# EAGLE board WP75xx 2 no usb_v (EAGLE 7.7.0)
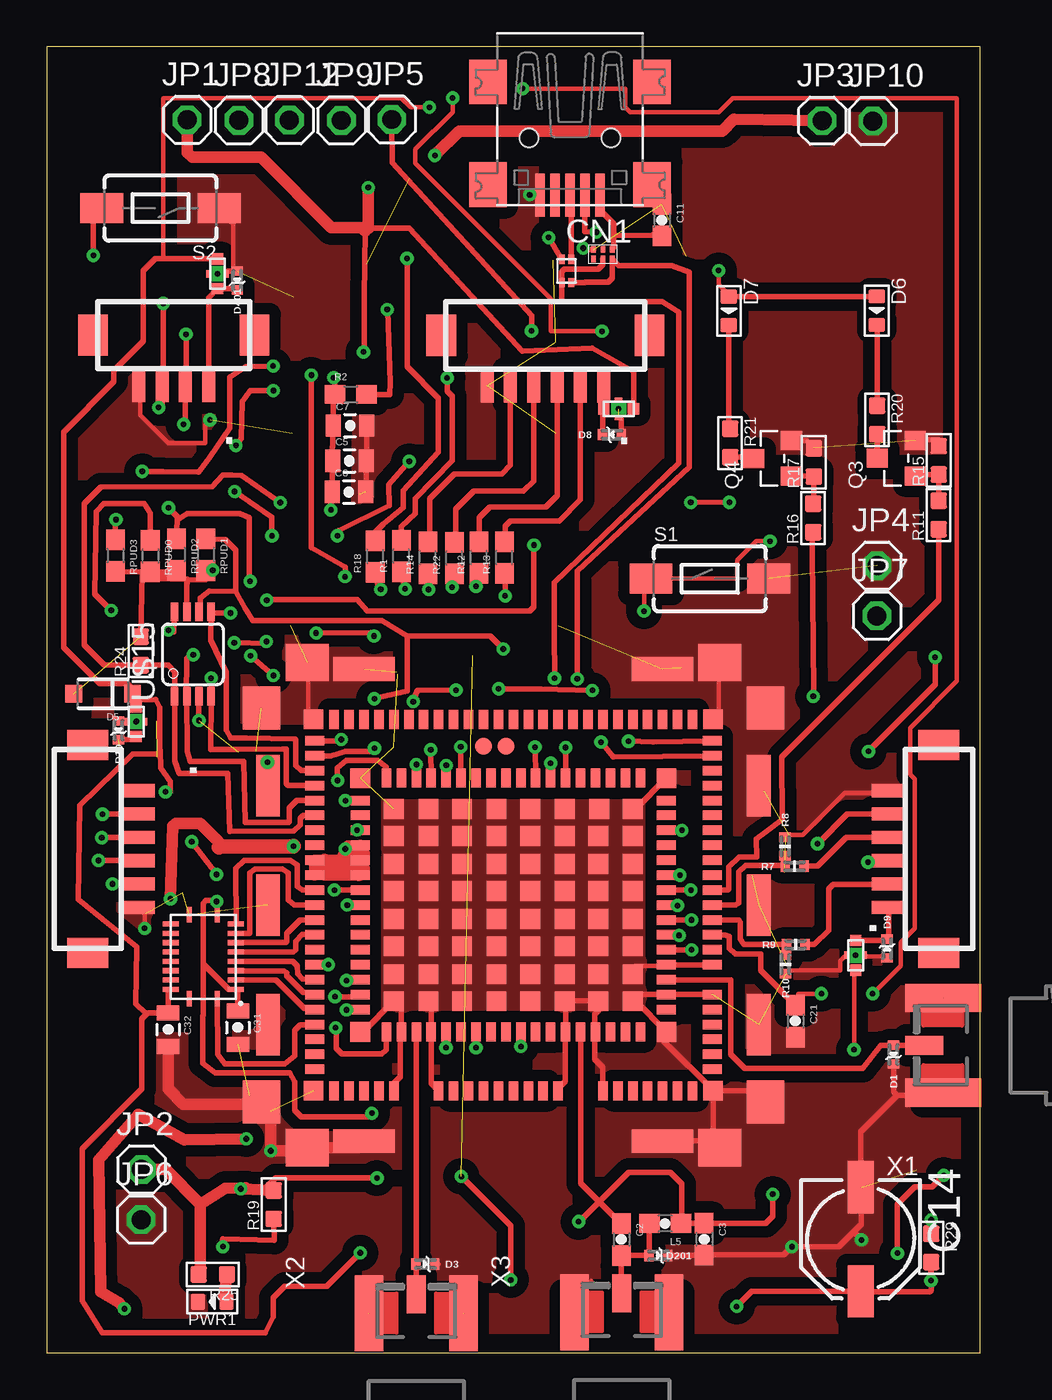
[diagram p1: board, top side]
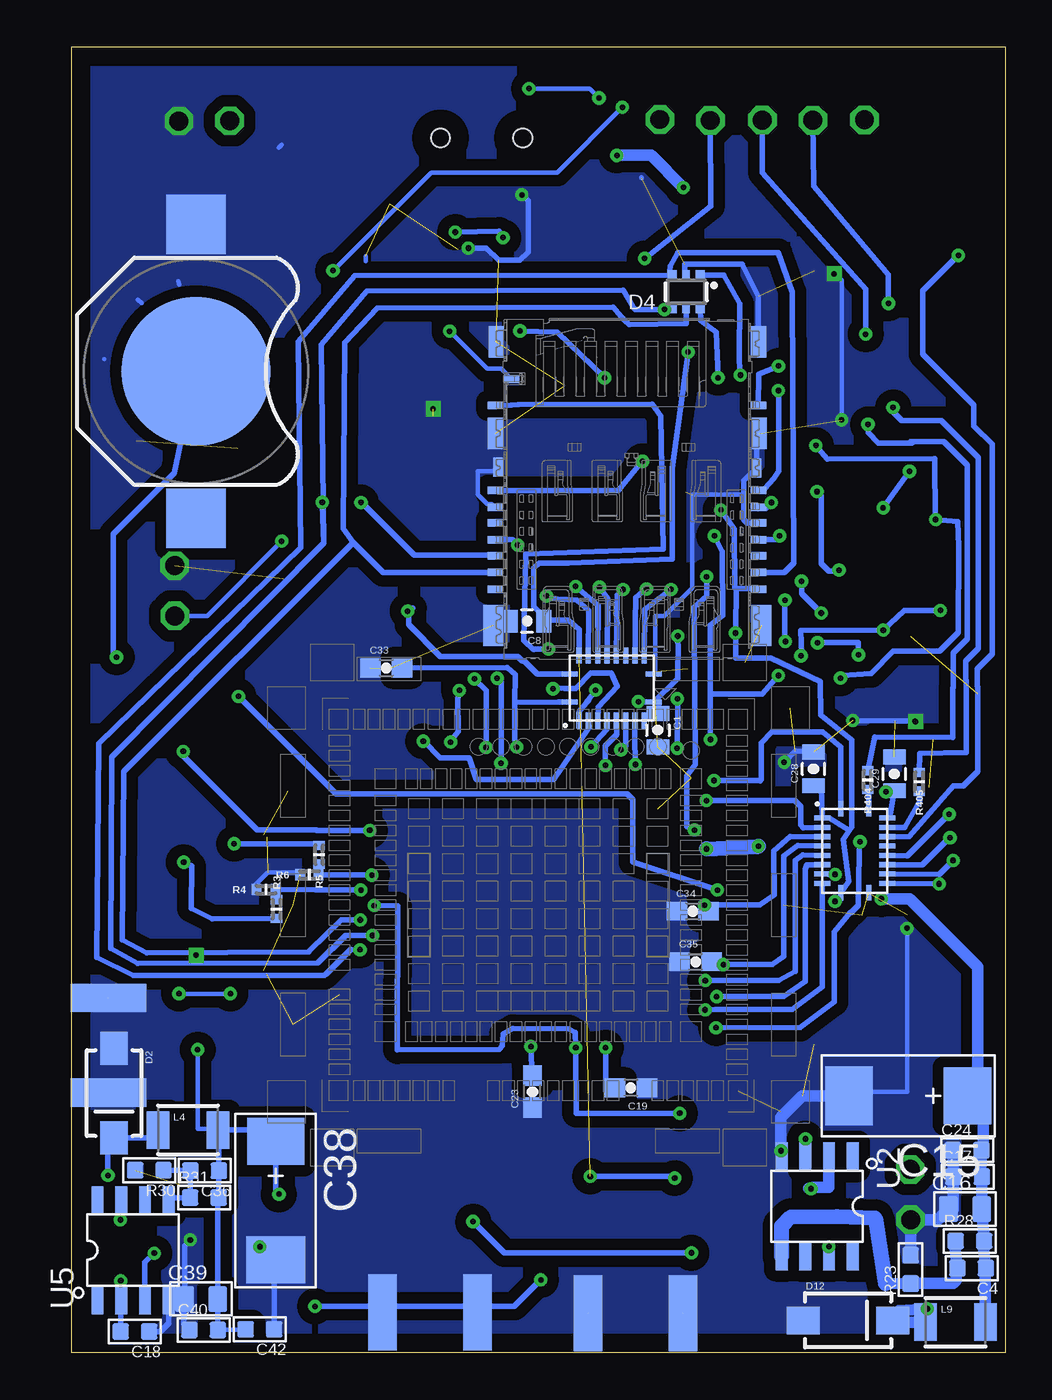
[diagram p2: board, bottom side, seen from below]

Size 50 x 70 mm. Coordinates in mm from the lower left corner, seen from the top.
Outline: 0,0 50,0 50,70 0,70 0,0
Copper layers (1*16): Top 0.035mm / dielectric 1.5mm / Bottom 0.035mm
Design rules "default": minimum track width 10mil, minimum drill 24mil, track to track 8mil, track to pad 8mil, pad to pad 8mil, via to via 8mil, smd to smd 8mil, copper to edge 40mil, drill to drill 8mil, minimum pad ring 10mil, minimum via ring 8mil, stop-mask expansion 4mil, vias tented up to drill 0mil, thermal gap 10mil
Net classes: 0 default: width 0.254 mm, clearance 0.254 mm; 1 power: width 0.15 mm, drill 0.2 mm, clearance 0.152 mm; 3 usbvcc: width 0.508 mm, drill 0.61 mm, clearance 0.254 mm

## Footprints (pad centres in the part's own frame; a part is rotated, then mirrored left to right if it is on the bottom)
BATTCON_12MM = smd 8 x 8: GND 0,0 | smd 3.175 x 3.175: PWR@1 -7.874,0; PWR@2 7.874,0
0805-CAP = smd 0.8 x 1.2: 1 -0.9,0; 2 0.9,0
0603-CAP = smd 1.1 x 1: 1 -0.85,0; 2 0.85,0
C0603 = smd 0.889 x 0.889: 1 -0.762,0; 2 0.762,0
ELECTRO-SMD-D-5.6MM = smd 2.794 x 1.397: + 2.794,0; - -2.794,0
AVX-D = smd 2.54 x 3.048: + -3.175,0 | smd 2.54 x 3.175: - 3.175,0
C0805 = smd 1.016 x 1.397: 1 -0.889,0; 2 0.889,0
USB-MINIB = smd 0.5 x 2.308: D+ 0,4.064; D- -0.8,4.064; GND 1.6,4.064; ID 0.8,4.064; VBUS -1.6,4.064 | smd 2 x 2.4: GND1 -4.4,-2; GND2 -4.4,3.5; GND3 4.4,3.5; GND4 4.4,-2 | hole 1: -2.2,1; 2.2,1
0402-TVS = smd 0.5 x 0.6: A 0.5,0; C -0.5,0
SMA-DIODE-KIT = smd 1.77 x 1.47: A -2.4,0; C 2.4,0
SOT363 = smd 0.5 x 0.5: 1 -0.75,-0.9; 3 0.75,-0.9; 4 0.75,0.9; 6 -0.75,0.9 | smd 0.4 x 0.5: 2 0,-0.9; 5 0,0.9
SOD-123 = smd 0.9 x 0.95: A 1.575,0; C -1.575,0
LED-0603 = smd 0.762 x 0.889: + -0.762,0; - 0.762,0
DF13C-6P-1.25V = smd 0.7 x 1.8: 1 -3.125,0.9; 2 -1.875,0.9; 3 -0.625,0.9; 4 0.625,0.9; 5 1.875,0.9; 6 3.125,0.9 | smd 1.6 x 2.2: M$0 5.575,-1.8; M$1 -5.575,-1.8
DF13C-4P-1.25V = smd 0.7 x 1.8: 1 -1.875,0.9; 2 -0.625,0.9; 3 0.625,0.9; 4 1.875,0.9 | smd 1.6 x 2.2: M$0 4.325,-1.8; M$1 -4.325,-1.8
1X01 = drill 1.016 octagon: 1 0,0
KYOCERA-KNH16-DA = smd 0.6 x 0.6: P$1 -0.8,0; P$2 0.8,0 | smd 0.4 x 0.4: P$3 0,-0.4; P$4 0,0.4 | drill 0.3 pad 0.4 square: P$5 0,0
1210 = smd 1.2 x 2: 1 -1.6,0; 2 1.6,0
0603 = smd 1.1 x 1: 1 -0.85,0; 2 0.85,0
D0603 = smd 0.762 x 0.889: + -0.762,0; - 0.762,0
SOT23 = smd 1.016 x 1.143: 1 -0.95,-1.016; 2 0.95,-1.016; 3 0,1.016
0402-RES = smd 0.5 x 0.6: P$1 -0.5,0; P$2 0.5,0
R0603 = smd 0.889 x 0.889: 1 -0.762,0; 2 0.762,0
TACTILE-SWITCH-1101NE = smd 2.3 x 1.6: 1 -3.15,0; 2 3.15,0
QFN20-RGY = smd 0.28 x 0.85: 1 -0.75,2.25; 10 -0.75,-2.25; 11 0.75,-2.25; 20 0.75,2.25 | smd 0.85 x 0.28: 2 -1.75,1.75; 3 -1.75,1.25; 4 -1.75,0.75; 5 -1.75,0.25; 6 -1.75,-0.25; 7 -1.75,-0.75; 8 -1.75,-1.25; 9 -1.75,-1.75; 12 1.75,-1.75; 13 1.75,-1.25; 14 1.75,-0.75; 15 1.75,-0.25; 16 1.75,0.25; 17 1.75,0.75; 18 1.75,1.25; 19 1.75,1.75
SOP8 = smd 0.635 x 1.524: 1 -1.905,-2.667; 2 -0.635,-2.667; 3 0.635,-2.667; 4 1.905,-2.667; 5 1.905,2.667; 6 0.635,2.667; 7 -0.635,2.667; 8 -1.905,2.667
SOCKET_WP75XX = smd 0.508 x 1.016: P$1 6.8,-6.8; P$2 6,-6.8; P$3 5.2,-6.8; P$4 4.4,-6.8; P$5 3.6,-6.8; P$6 2.8,-6.8; P$7 2,-6.8; P$8 1.2,-6.8; P$9 0.4,-6.8; P$10 -0.4,-6.8; P$11 -1.2,-6.8; P$12 -2,-6.8; P$13 -2.8,-6.8; P$14 -3.6,-6.8; P$15 -4.4,-6.8; P$16 -5.2,-6.8; P$17 -6,-6.8; P$18 -6.8,-6.8; P$34 -6.8,6.8; P$35 -6,6.8; P$36 -5.2,6.8; P$37 -4.4,6.8; P$38 -3.6,6.8; P$39 -2.8,6.8; P$40 -2,6.8; P$41 -1.2,6.8; P$42 -0.4,6.8; P$43 0.4,6.8; P$44 1.2,6.8; P$45 2,6.8; P$46 2.8,6.8; P$47 3.6,6.8; P$48 4.4,6.8; P$49 5.2,6.8; P$50 6,6.8; P$51 6.8,6.8; P$71 9.6,-9.95; P$72 8.8,-9.95; P$73 8,-9.95; P$74 7.2,-9.95; P$75 6.4,-9.95; P$76 5.6,-9.95; P$77 4.8,-9.95; P$78 4,-9.95; P$79 3.2,-9.95; P$80 2.4,-9.95; P$81 1.6,-9.95; P$82 0.8,-9.95; P$83 0,-9.95; P$84 -0.8,-9.95; P$85 -1.6,-9.95; P$86 -2.4,-9.95; P$87 -3.2,-9.95; P$88 -4,-9.95; P$89 -4.8,-9.95; P$90 -5.6,-9.95; P$91 -6.4,-9.95; P$92 -7.2,-9.95; P$93 -8,-9.95; P$94 -8.8,-9.95; P$95 -9.6,-9.95; P$119 -9.6,9.95; P$120 -8.8,9.95; P$121 -8,9.95; P$122 -7.2,9.95; P$123 -6.4,9.95; P$124 -5.6,9.95; P$125 -4.8,9.95; P$128 -2.4,9.95; P$129 -1.6,9.95; P$130 -0.8,9.95; P$131 0,9.95; P$132 0.8,9.95; P$133 1.6,9.95; P$134 2.4,9.95; P$135 3.2,9.95; P$136 4,9.95; P$139 6.4,9.95; P$140 7.2,9.95; P$141 8,9.95; P$142 8.8,9.95; P$143 9.6,9.95 | smd 1.016 x 0.508: P$19 -8.2,-5.6; P$20 -8.2,-4.8; P$21 -8.2,-4; P$22 -8.2,-3.2; P$23 -8.2,-2.4; P$24 -8.2,-1.6; P$25 -8.2,-0.8; P$26 -8.2,0; P$27 -8.2,0.8; P$28 -8.2,1.6; P$29 -8.2,2.4; P$30 -8.2,3.2; P$31 -8.2,4; P$32 -8.2,4.8; P$33 -8.2,5.6; P$52 8.2,5.6; P$53 8.2,4.8; P$54 8.2,4; P$55 8.2,3.2; P$56 8.2,2.4; P$57 8.2,1.6; P$58 8.2,0.8; P$59 8.2,0; P$60 8.2,-0.8; P$61 8.2,-1.6; P$62 8.2,-2.4; P$63 8.2,-3.2; P$64 8.2,-4; P$65 8.2,-4.8; P$66 8.2,-5.6; P$96 -10.65,-8.8; P$97 -10.65,-8; P$98 -10.65,-7.2; P$99 -10.65,-6.4; P$100 -10.65,-5.6; P$101 -10.65,-4.8; P$102 -10.65,-4; P$103 -10.65,-3.2; P$104 -10.65,-2.4; P$105 -10.65,-1.6; P$106 -10.65,-0.8; P$107 -10.65,0; P$108 -10.65,0.8; P$109 -10.65,1.6; P$110 -10.65,2.4; P$111 -10.65,3.2; P$113 -10.65,4.8; P$114 -10.65,5.6; P$115 -10.65,6.4; P$116 -10.65,7.2; P$117 -10.65,8; P$118 -10.65,8.8; P$144 10.65,8.8; P$145 10.65,8; P$146 10.65,7.2; P$147 10.65,6.4; P$148 10.65,5.6; P$149 10.65,4.8; P$150 10.65,4; P$151 10.65,3.2; P$152 10.65,2.4; P$153 10.65,1.6; P$154 10.65,0.8; P$155 10.65,0; P$156 10.65,-0.8; P$157 10.65,-1.6; P$158 10.65,-2.4; P$159 10.65,-3.2; P$160 10.65,-4; P$161 10.65,-4.8; P$162 10.65,-5.6; P$163 10.65,-6.4; P$164 10.65,-7.2; P$165 10.65,-8; P$166 10.65,-8.8 | smd 1.05 x 1.05: P$67 8.2,-6.8; P$68 -8.2,-6.8; P$69 -8.2,6.8; P$70 8.2,6.8; P$167 10.7,-9.95; P$168 -10.7,-9.95; P$169 -10.7,9.95; P$170 10.7,9.95 | smd 1.06 x 1.06: P$171 6.4,-5.15; P$172 6.4,-3.7; P$173 6.4,-2.2; P$174 6.4,-0.75; P$175 6.4,0.75; P$176 6.4,2.2; P$177 6.4,3.7; P$178 6.4,5.15; P$179 4.55,5.15; P$180 2.75,5.15; P$181 0.9,5.15; P$182 -0.9,5.15; P$183 -2.75,5.15; P$184 -4.55,5.15; P$185 -6.4,5.15; P$186 -6.4,3.7; P$187 -6.4,2.2; P$188 -6.4,0.75; P$189 -6.4,-0.75; P$190 -6.4,-2.2; P$191 -6.4,-3.7; P$192 -6.4,-5.15; P$193 -4.6,-5.15; P$194 -2.75,-5.15; P$195 -0.9,-5.15; P$196 0.9,-5.15; P$197 2.75,-5.15; P$198 4.55,-5.15; P$199 4.55,-3.7; P$200 4.55,-2.2; P$201 4.55,-0.75; P$202 4.55,0.75; P$203 4.55,2.2; P$204 4.55,3.7; P$205 2.75,3.7; P$206 0.9,3.7; P$207 -0.9,3.7; P$208 -2.75,3.7; P$209 -4.55,3.7; P$210 -4.55,2.2; P$211 -4.55,0.75; P$212 -4.55,-0.75; P$213 -4.55,-2.2; P$214 -4.55,-3.7; P$215 -2.75,-3.7; P$216 -0.9,-3.7; P$217 0.9,-3.7; P$218 2.75,-3.7; P$219 2.75,-2.2; P$220 2.75,-0.75; P$221 2.75,0.75; P$222 2.75,2.2; P$223 0.9,2.2; P$224 -0.9,2.2; P$225 -2.75,2.2; P$226 -2.75,0.75; P$227 -2.75,-0.75; P$228 -2.75,-2.2; P$229 -0.9,-2.2; P$230 0.9,-2.2; P$231 0.9,-0.75; P$232 0.9,0.75; P$233 -0.9,0.75; P$234 -0.9,-0.75 | smd 0.9 x 0.9: P$240 1.6,-8.5; P$241 0.4,-8.5 | smd 1.27 x 3.3: P$245 -13.15,-6.4; P$246 -13.15,0; P$247 -13.15,6.4; P$250 13.15,6.4; P$251 13.15,0; P$252 13.15,-6.4 | smd 3.3 x 1.27: P$248 -8,12.65; P$249 8,12.65; P$253 8,-12.65; P$254 -8,-12.65 | smd 2 x 2.3: P$255 -13.5,-10.55; P$258 13.5,-10.55; P$259 13.5,10.55; P$262 -13.5,10.55 | smd 2.3 x 2: P$256 -11.05,-13; P$257 11.05,-13; P$260 11.05,13; P$261 -11.05,13
TCM1210G = smd 0.3 x 0.5: 1 -0.25,-0.75; 2 0.25,-0.75; 3 0.25,0.5; 4 -0.25,0.5
TPD4S012 = smd 0.35 x 0.25: P$1 -0.25,-0.5; P$2 -0.25,0; P$3 -0.25,0.5; P$4 0.25,0.5; P$5 0.25,0; P$6 0.25,-0.5
SIM_SD_HOLDER = smd 0.813 x 0.406: - -6.95,0; -- -6.95,-3.55; C1 7.15,-3.55; C2 7.15,-2.65; C3 -6.95,-2.65; C4 7.15,0; C5 7.15,-1.75; C6 -6.95,-1.75; SW -6.07,7.71; T1 7.15,6.3; T2 7.15,1.75; T3 7.15,0.85; T4 7.15,-0.9; T5 -6.95,-0.9; T6 -6.95,0.85; T7 -6.95,1.75; T8 -6.95,6.3 | smd 1.067 x 2.184: G1 -7.05,-5.5; G8 7.3,-5.5 | smd 0.508 x 1.016: G2 -6.8,3; G7 7.05,2.95 | smd 0.813 x 1.676: G3 -6.95,4.8; G4 -6.9,9.7; G5 7.15,9.7; G6 7.2,4.8
MSOP8 = smd 0.4 x 1: 1 -0.976,-2.263; 2 -0.326,-2.263; 3 0.324,-2.263; 4 0.974,-2.263; 5 0.974,2.262; 6 0.324,2.262; 7 -0.326,2.262; 8 -0.976,2.262
SMA_EDGELAUNCH_UFL = smd 4.064 x 1.524: GND@1 2.032,-2.54; GND@2 2.032,2.54 | smd 4.064 x 1.524 bottom: GND@3 2.032,2.54; GND@4 2.032,-2.54 | smd 2.032 x 1.016: P 3.048,0

## Placement (x,y rotation side)
BAT2  [BATTCON_12MM]  43.34,52.6 270 bottom
C1  100nf  [0805-CAP]  18.6,33.37 270 bottom
C2  15pf  [0603-CAP]  30.79,6.08 270 top
C3  22pf  [0603-CAP]  35.22,6.1 270 top
C4  DNP  [C0603]  1.79,4.53 180 bottom
C5  100nf  [0805-CAP]  16.22,47.8 0 top
C6  10nf  [0805-CAP]  16.2,46.14 0 top
C7  4.7uf  [0805-CAP]  16.25,49.69 0 top
C8  100nf  [0805-CAP]  25.61,39.21 180 bottom
C11  10uf  [0603-CAP]  32.96,60.71 270 top
C14  16V 220uF  [ELECTRO-SMD-D-5.6MM]  43.6,6.09 270 top
C15  470uF  [AVX-D]  5.18,13.77 180 bottom
C16  10uF  [C0805]  2.14,7.7 0 bottom
C17  100nF  [C0603]  2,9.44 0 bottom
C18  100nF  [C0603]  46.61,1.14 180 bottom
C19  22pf  [0603-CAP]  20.04,14.21 180 bottom
C21  22pf  [0603-CAP]  40.11,17.78 270 top
C23  22pf  [0603-CAP]  25.31,13.99 90 bottom
C24  100nF  [C0603]  2.03,10.86 0 bottom
C28  100nf  [0805-CAP]  10.26,31.29 90 bottom
C29  100nf  [0805-CAP]  5.93,31.02 90 bottom
C31  100nf  [0805-CAP]  10.24,17.43 270 top
C32  100nf  [0805-CAP]  6.51,17.32 270 top
C33  22pf  [0603-CAP]  33.15,36.7 0 bottom
C34  22pf  [0603-CAP]  16.73,23.67 0 bottom
C35  22pf  [0603-CAP]  16.58,20.96 0 bottom
C36  DNP  [C0603]  42.88,9.77 180 bottom
C38  470uF  [AVX-D]  39.07,8.16 270 bottom
C39  10uF  [C0805]  43.07,2.89 0 bottom
C40  100nF  [C0603]  42.93,1.22 0 bottom
C42  100nF  [C0603]  39.92,1.26 180 bottom
CN1  [USB-MINIB]  28.04,66.11 180 top
D1  [0402-TVS]  45.37,15.98 90 top
D2  [SMA-DIODE-KIT]  47.73,13.92 270 bottom
D3  [0402-TVS]  20.29,4.76 180 top
D4  SMF05C  [SOT363]  17.08,56.86 180 bottom
D5  [SOD-123]  3.03,35.32 180 top
D6  green  [LED-0603]  44.46,55.85 270 top
D7  green  [LED-0603]  36.55,55.84 270 top
D8  PESD0402-140  [0402-TVS]  30.28,49.21 0 top
D9  PESD0402-140  [0402-TVS]  45.02,21.66 270 top
D10  PESD0402-140  [0402-TVS]  3.85,33.37 90 top
D12  [SMA-DIODE-KIT]  8.4,1.74 0 bottom
D201  [0402-TVS]  32.77,5.21 180 top
D401  [0402-TVS]  10.21,57.47 90 top
J1  DF13C-6P-1.25V  [DF13C-6P-1.25V]  4,27 270 top
J5  DF13C-6P-1.25V  [DF13C-6P-1.25V]  46,27 90 top
J201  [DF13C-6P-1.25V]  26.72,52.73 180 top
J401  [DF13C-4P-1.25V]  6.81,52.75 180 top
JP1  [1X01]  7.53,66.08 0 top
JP2  [1X01]  5.08,9.82 0 top
JP3  [1X01]  41.54,66.03 0 top
JP4  [1X01]  44.48,42.19 0 top
JP5  [1X01]  18.49,66.1 0 top
JP6  [1X01]  5.06,7.14 0 top
JP7  [1X01]  44.47,39.49 0 top
JP8  [1X01]  10.29,66.05 0 top
JP9  [1X01]  15.79,66.05 0 top
JP10  [1X01]  44.25,66.01 0 top
JP12  [1X01]  13,66.07 0 top
L1  KNH16C104DA5TS  [KYOCERA-KNH16-DA]  4.79,33.83 270 top
L3  KNH16C104DA5TS  [KYOCERA-KNH16-DA]  43.34,21.3 90 top
L4  10uh  [1210]  43.77,11.95 0 bottom
L5  [0603]  33.14,6.94 180 top
L7  [KYOCERA-KNH16-DA]  9.15,57.83 270 top
L9  10uh  [1210]  2.65,1.65 0 bottom
L201  KNH16C104DA5TS  [KYOCERA-KNH16-DA]  30.64,50.59 180 top
PWR1  Red  [D0603]  8.87,2.75 180 top
Q3  9013  [SOT23]  45.51,47.95 90 top
Q4  9013  [SOT23]  38.89,47.93 90 top
R1  120r  [0603]  19,42.7 90 top
R2  15k  [0603]  16.29,51.36 0 top
R3  10K/0.1%  [0402-RES]  39.03,23.78 270 bottom
R4  10K/0.1%  [0402-RES]  39.59,24.83 0 bottom
R5  10K/0.1%  [0402-RES]  36.75,26.69 90 bottom
R6  10K/0.1%  [0402-RES]  37.27,25.62 0 bottom
R7  10K/0.1%  [0402-RES]  40.07,26.08 0 top
R8  10K/0.1%  [0402-RES]  39.56,27.14 270 top
R9  10K/0.1%  [0402-RES]  40.13,21.88 0 top
R10  10K/0.1%  [0402-RES]  39.58,20.82 90 top
R11  4.7k  [R0603]  47.78,44.9 90 top
R12  120r  [0603]  23.15,42.62 90 top
R13  120r  [0603]  24.52,42.62 90 top
R14  120r  [0603]  20.42,42.6 90 top
R15  47k  [R0603]  47.79,47.83 90 top
R16  4.7k  [R0603]  41.06,44.74 90 top
R17  47k  [R0603]  41.1,47.72 90 top
R18  120r  [0603]  17.61,42.67 90 top
R19  100k  [R0603]  12.16,7.95 90 top
R20  1k  [R0603]  44.49,50 270 top
R21  1K  [R0603]  36.61,48.76 270 top
R22  120r  [0603]  21.84,42.6 90 top
R23  10k 1%  [R0603]  5.06,4.47 90 bottom
R24  1K  [R0603]  5.04,37.62 90 top
R25  330  [R0603]  8.9,4.2 180 top
R28  24k 1%  [R0603]  1.89,5.99 0 bottom
R29  100k  [R0603]  47.38,5.63 270 top
R30  10k 1%  [R0603]  45.84,9.78 180 bottom
R31  24k 1%  [R0603]  42.89,8.32 0 bottom
R404  120R  [0402-RES]  7.36,30.7 90 bottom
R405  120R  [0402-RES]  4.59,30.61 90 bottom
RPUD0  47k  [0603]  5.55,42.7 270 top
RPUD1  47k  [0603]  8.52,42.77 270 top
RPUD2  47k  [0603]  6.96,42.78 270 top
RPUD3  47k  [0603]  3.68,42.73 270 top
S1  [TACTILE-SWITCH-1101NE]  35.52,41.49 0 top
S2  [TACTILE-SWITCH-1101NE]  6.1,61.35 180 top
U1  TXS0108QFN20  [QFN20-RGY]  8.05,26.91 0 bottom
U2  TD1410  [SOP8]  10.06,7.86 180 bottom
U3  TXS0108QFN20  [QFN20-RGY]  8.39,21.23 180 top
U5  TD1410  [SOP8]  46.71,5.51 0 bottom
U201  TXS0108QFN20  [QFN20-RGY]  21.07,35.63 90 bottom
U$1  SOCKETY_WP75XXX  [SOCKET_WP75XX]  25,24 180 top
U$11  TCM1210G  [TCM1210G]  27.85,58.1 0 top
U$12  TPD4S012  [TPD4S012]  29.8,58.88 90 top
U$14  SD_SIM_M1610  [SIM_SD_HOLDER]  20.36,44.47 0 bottom
U$15  PACDN006  [MSOP8]  7.83,37.45 0 top
X1  uFL  [SMA_EDGELAUNCH_UFL]  50.06,16.48 180 top
X2  uFL  [SMA_EDGELAUNCH_UFL]  19.8,0.08 90 top
X3  uFL  [SMA_EDGELAUNCH_UFL]  30.81,0.14 90 top

## Tracks (layer width: path | path; a pad name or v marks a point on that pad's centre or on a via)
1.8V  (via drill 0.3)
  Top 0.254: 15.3,46.25 15.25,46.25 C6.1
  Top 0.305: U$1.P$26 v33.8,23.97 | U$1.P$45 22.98,16.55 v23,16.35 | C31.1 10.24,19.38 U3.2 9.76,19.48 8.38,20.85 | 8.38,20.85 8.38,24.09 8.53,24.23 9.04,24.23 9.14,24.14 | 9.14,24.14 U3.10 | 8.38,20.85 8.38,18.08 8.36,18.06 8.36,15.51 9.04,15.01 13.02,15.01 13.29,14.52 13.29,13.01 13.64,12.66 17.24,12.66 v17.42,12.84 | v9.11,24.19 9.11,24.24 9.14,24.14 | v17.53,38.41 17.39,38.59 v14.44,38.58 | v15.22,45.17 15.22,46.06 C6.1 | 15.3,46.11 15.3,46.25 15.3,48.26 | 15.3,48.26 15.3,48.54 15.34,48.57 15.34,49.68 C7.1 15.35,51.28 R2.1 15.44,52.19 v15.37,52.26 | C5.1 15.32,48.24 15.3,48.26 | v19.64,34.9 19.87,35.51 v21.93,35.52
  Bottom 0.254: 14.42,38.75 14.5,38.75 v14.44,38.58
  Bottom 0.305: v33.8,23.97 32.54,23.94 32.56,16.24 27.1,16.28 26.93,16.44 26.89,17.09 26.37,17.39 23.38,17.37 23.02,17.17 v23,16.36 v23,16.35 22.98,12.86 22.96,12.84 v17.42,12.84 | C28.1 9.85,30.42 U1.2 9.42,28.65 8.35,27.99 | 8.35,27.99 8.66,27.51 8.36,25.26 U1.10 8.84,24.27 v9.11,24.19 | 8.35,27.99 8.2,28.19 8.22,32.83 9.87,34.18 9.89,35.98 12.55,37.25 14.44,37.24 14.42,38.75 14.4,41 14.47,41.03 | 14.47,41.03 14.46,40.95 13.74,40.95 U$14.C1 | 14.47,41.03 14.5,44.13 14.79,44.58 v15.22,45.17 | D4.6 16.31,55.31 15.88,54.99 15.47,54.7 v15.37,52.26 | v17.53,38.41 17.52,37.6 17.54,36.68 17.52,36.14 U201.10 | U201.2 22.8,34.38 22.31,34.99 22.4,34.89 v21.93,35.52 | U201.10 19.62,34.88 v19.64,34.9 | C1.1 18.54,34.88 U201.10
3.7V  (via drill 0.3)
  Top 0.305: 15.82,26.56 16.14,26 v16,27.01
  Top 0.61: U$1.P$63 17.02,26.78 16.16,27.16 | 16.16,27.16 16.41,25.99 14.88,26.44 14.88,26.4 U$1.P$158 U$1.P$157 | U$1.P$62 14.9,26.4 14.9,25.61 15.35,25.61 | 16.16,27.16 15.82,26.56 16.73,25.59 15.35,25.61 | 15.35,25.61 15.35,26.03 17.01,25.97 U$1.P$61 | 9.23,27.11 9.23,27.39 8.24,28.38 6.9,28.38 6.75,28.23 v6.63,24.33
  Top 0.813: v13.21,27.15 9.23,27.11
  Bottom 0.61: v6.63,24.33 5.11,24.33 1.46,20.68 1.46,14.32 C15.+ 2,13.29 1.15,12.44 1.15,10.83 C24.2 1.29,9.23 C17.2 1.25,9.16 C16.2 1.21,7.37 R28.2 1.14,5.43 C4.1 1.05,4.51 L9.2
  Bottom 0.813: v16,27.01 v13.21,27.15
21
  Top 0.305: U3.1 9.15,16 9.53,15.49 12.77,15.49 13.28,15.9 13.29,17.28 13.59,17.57 14.32,17.57 U$1.P$147
22
  Top 0.305: U3.3 12.28,20 13.79,18.45 14.34,18.41 U$1.P$148
23
  Top 0.305: U3.4 12.7,20.48 12.86,20.35 12.85,20.2 13.74,19.3 U$1.P$149
24
  Top 0.305: U3.5 13.19,20.98 13.43,20.75 13.45,20.31 13.7,20.05 14.34,20.01 U$1.P$150
28
  Top 0.305: U3.6 13.21,21.48 13.34,21.61 13.34,22.05 13.7,22.41 14.34,22.41 U$1.P$153
29
  Top 0.305: U$1.P$154 13.59,23.2 12.87,22.48 12.87,22.06 12.81,22 10.16,22 U3.7
30
  Top 0.305: U3.8 10.84,22.48 10.88,22.51 10.88,25.72 11.18,25.94 12.62,25.94 12.93,25.72 12.94,24.28 13.26,23.99 U$1.P$155
31
  Top 0.305: U$1.P$156 13.7,24.8 13.43,24.99 13.43,26.16 13.05,26.38 10.59,26.38 10.14,25.95 10.15,23 U3.9
+3V3  (via drill 0.3)
  Top 0.254: v43.25,16.25 43.25,20.5 L3.P$1 | v36,58 36,57.25 36.5,56.75 D7.+ | v20.5,66.75 19.5,66.75 19,67.25 6.25,67.25 6.25,58.63 | 5,34.99 5,35 4.75,35.25 D5.C
  Top 0.305: C32.1 6.51,19.35 U3.19 | v6.37,30.06 6.63,30.06 6.63,30.61 6.1,31.33 6.1,31.52 6.08,32.1 | 6.08,32.1 6.06,32.59 6.07,34.57 5.84,35.01 5,34.99 4.93,34.99 L1.P$1 | C32.1 5.27,18.23 4.79,18.71 4.83,21.77 1.69,24.29 1.76,29.35 4.6,32.08 6.06,32.08 6.08,32.1 | C32.1 5.42,18.23 5.1,17.91 5.1,14.15 1.9,10.95 1.9,2.78 2.98,1.09 11.71,1.09 12.13,1.93 12.13,2.94 12.77,3.57 15.01,3.57 v16.8,5.36 | v28.5,7.03 28.53,7.03 31.18,9.68 33.4,9.68 34.03,9.05 34.03,6.99 L5.1 C3.1 38.51,6.94 38.9,7.32 v38.9,8.5 | L7.P$1 6.25,58.63 5.81,58.63 5.18,58 5.18,54.23 3.6,52.65 3.6,52.04 0.9,49.34 0.9,37.81 2.83,35.88 4.31,35.88 4.6,35.58 D5.C | D7.+ 44.45,56.6 D6.+
  Bottom 0.254: v43.25,16.25 43.25,12 42.25,12 L4.2 | C42.2 40.75,1.25 42,1.25 C40.2 | v36,58 30.75,63.25 24,63.25 v20.5,66.75
  Bottom 0.305: U1.19 6.17,28.68 C29.1 6.31,30.12 v6.37,30.06 | v16.8,5.36 26.83,5.36 v28.5,7.03 | C40.2 42.18,1.23 C39.2 42.18,8.27 R31.2 42.13,9.75 C36.1 42.11,11.89 L4.2 39.68,11.95 C38.+ 39.07,8.68 v38.9,8.5
+5V  (via drill 0.3)  (1 unrouted)
  Top 0.305: R25.2 8.23,4.13 | 10.68,8.85 v10.39,8.79 10.54,8.65 11.55,8.65 12.28,9.37 v17.69,9.37 | v47.37,3.87 47.37,4.85 R29.2 47.38,3.34 47.31,3.27 43.63,3.27 C14.+ 37.77,3.29 v36.97,2.49 | v24.86,3.91 24.86,6.81 v22.22,9.45 | L201.P$1 31.44,52.58 29.22,53.85 25.48,53.68 19.42,60.26 17.26,60.28 17.08,60.29 17.08,60.11 17.01,56.6 17.01,53.67 v16.97,53.63
  Top 0.61: R19.2 v10.39,8.79 | 8.23,4.13 8.23,4.46 8.24,7.97 | 8.24,7.97 9.57,8.83 10.68,8.85 | JP2.1 6.39,9.82 8.24,7.97 | JP1.1 7.53,64.33 7.79,64.06 11.49,64.06 15.26,60.3 16.89,60.3 17.08,60.11 | JP3.1 36.82,66.1 36.19,65.48 22.1,65.48 v20.8,64.17 | v17.23,62.45 17.23,60.31 17.26,60.28
  Bottom 0.254: 10.25,8.87 10.25,9 v10.39,8.79 | 17.5,9.5 v17.69,9.37
  Bottom 0.305: U201.19 22.82,38.77 23.39,39.27 24.65,39.27 C8.1 24.71,39.49 25.24,40.01 25.24,42.06 24.96,42.32 23.41,42.32 17.83,42.54 17.83,47.42 v16.97,53.63 | C18.2 47.37,2.81 U5.2 47.35,3.84 v47.37,3.87 | v36.97,2.49 26.28,2.49 v24.86,3.91 | v22.22,9.45 17.78,9.45 v17.69,9.37
  Bottom 0.61: U2.2 9.43,8.87 10.25,8.87 10.28,8.87 | v10.39,8.79 10.52,8.82 | v20.8,64.17 18.95,64.17 v17.23,62.45
ADC0  (via drill 0.3)
  Top 0.305: U$1.P$25 v34.51,24.8
  Bottom 0.305: v34.51,24.8 36.86,24.8 36.79,24.82 36.93,24.81 R4.P$2 39.09,24.16 R3.P$1
ADC1  (via drill 0.3)
  Top 0.305: U$1.P$24 v33.92,25.6
  Bottom 0.254: R6.P$2 36.75,25.75 36.75,25.6
  Bottom 0.305: v33.92,25.6 36.75,25.6 36.78,25.6 36.79,25.59 | R5.P$1 36.8,25.65 R6.P$2
ADC2
  Top 0.254: R8.P$2 39.75,26.5 39.75,26.25 R7.P$1 39.5,26.25 39.43,26.12
  Top 0.305: U$1.P$107 36.9,24 37.08,24.1 37.08,25.76 37.44,26.12 39.43,26.12
ADC3
  Top 0.254: R10.P$2 39.75,21.5 39.75,21.75 R9.P$1 39.5,22 39.42,21.9
  Top 0.305: U$1.P$108 37.09,23.2 37.15,23.07 37.15,22.18 37.34,21.9 39.42,21.9
BAT_RTC  (via drill 0.3)
  Top 0.305: U$1.P$21 v34.03,28 | v47.6,37.28 47.6,35.81 v44.02,32.23
  Bottom 0.305: v34.03,28 36.86,28 36.89,28.03 40.07,28.03 44.02,31.98 v44.02,32.23 | BAT2.GND 44.5,47.14 47.77,43.87 47.77,37.45 v47.6,37.28
BOOT_TPI  (via drill 0.3)
  Top 0.305: U$1.P$47 v21.39,16.36
  Bottom 0.254: C19.2 21,14.25 21.25,14.25 21.4,14.25
  Bottom 0.305: v21.39,16.36 21.4,14.25 21.4,14.03
D+  (via drill 0.3)
  Top 0.305: U$1.P$13 v27.8,32.44 | v28.42,36.12 28.41,38.78 28.41,41.91 34.42,47.47 34.42,57.92 33.49,58.27 30.66,58.27 U$12.P$1 30.3,57.6 30.09,57.39 28.86,57.39 28.83,57.35 U$11.2
  Bottom 0.305: v27.8,32.44 27.8,35.21 27.79,35.22 27.79,35.48 v28.42,36.12
D-  (via drill 0.3)
  Top 0.305: U$1.P$12 v27,31.6 | v27.21,36.15 27.18,38.64 27.19,38.64 27.19,41.29 33.87,47.68 33.87,55.76 32.97,56.33 27.73,56.33 27.6,56.45 U$11.1 27.58,57.37 27.58,57.93 27.72,58.07 29.54,58.07 29.8,58.33 U$12.P$2
  Bottom 0.305: v27,31.6 27,35.94 v27.21,36.15
GND  (via drill 0.3)  (37 unrouted)
  Top 0.254: 4.74,33.85 4.75,33.75 L1.P$5 | L201.P$3 30.75,51 30.75,50.75 L201.P$5 | 43.75,21.25 43.5,21.25 L3.P$5 43.25,21.25 43,21.25 L3.P$4 42.75,21.25 42.5,21 42.5,20.5 39.75,20.5 R10.P$1 | 43.75,21.25 45,21.25 D9.A | 43.75,21.25 L3.P$3 | U$1.P$167 14,34.25 14,37 U$1.P$257 | v5.25,22.75 5.25,23.5 5,23.75 J1.6 | U$1.P$30 33,20.75 31.5,20.75 31.5,20.5 U$1.P$186 | R8.P$1 39.75,27.75 40.5,27.75 42.75,30 45,30 J5.6 | U$1.P$168 36,34.25 36,37 U$1.P$256 | L7.P$3 8.75,57.75 9,57.75 L7.P$5 9.25,57.75 9.5,57.75 L7.P$4 | D401.A 10,58 10,60.5 9.25,61.25 S2.1 | v8.75,50 8.5,49.75 8.5,48.75 6.5,48.75 5,50.25 5,51.75 J401.4 | 29.25,3.75 29.17,3.86 | 21,4.75 D3.C
  Top 0.305: U$1.P$70 16.95,17.2 U$1.P$178 19,18.45 U$1.P$50 18.95,17.15 18.95,14.8 18.6,14.45 U$1.P$139 | U$1.P$179 20.6,18.7 U$1.P$48 20.6,14.45 U$1.P$136 | U$1.P$128 27.4,14.18 27.78,14.56 27.78,17.18 U$1.P$39 27.8,18.8 U$1.P$183 U$1.P$184 29.55,18.33 29.37,18.15 29.37,17.23 U$1.P$37 29.37,17.17 29.37,15.74 29.8,15.31 U$1.P$125 | U$1.P$169 33.07,16.69 33.07,17.07 U$1.P$69 31.55,18.85 U$1.P$185 31.75,19.2 U$1.P$32 U$1.P$113 | U$1.P$192 31.55,29.15 U$1.P$68 | U$1.P$111 U$1.P$30 | v11.83,31.65 11.83,30.42 U$1.P$252 | D10.A v4.82,33.86 4.74,33.85 L1.P$3 | U$15.3 v8.16,33.89 | v4.82,33.86 4.63,33.88 L1.P$4 | D1.C 45.37,13.98 45.56,13.79 | 45.56,13.79 47.88,13.79 X1.GND@2 | U$1.P$169 37.9,14.05 U$1.P$262 | U$1.P$169 35.7,11.35 | 35.7,11.35 U$1.P$261 | U$1.P$248 35.7,11.35 | 45.56,13.79 43.6,11.84 C14.- 43.64,8.85 43.64,6.9 43.23,6.5 | 43.23,6.5 42.42,5.68 v39.92,5.68 39.48,5.25 C3.2 35.19,5.21 D201.C | v43.65,6.05 43.65,6.09 43.23,6.5 | C7.2 17.15,47.84 C5.2 17.12,46.16 C6.2 | D401.A 9.69,57.97 L7.P$4 | 4.99,51.9 J401.4 | D8.A 30.78,50.05 L201.P$4 | U$12.P$4 28.82,59.13 v28.75,59.2 | v25.88,62.06 26.42,62.06 CN1.GND | 38.42,30.12 U$1.P$245 | R15.2 47.79,48.9 47.76,48.93 46.56,48.93 Q3.2 | Q4.2 40.71,48.88 R17.2
  Top 0.61: U$1.P$249 16.65,11 U$1.P$260 13.78,10.83 v12.01,10.83 12.01,12.95 11.62,13.33 | 11.62,13.33 U$1.P$259 | C32.2 6.51,14.14 7.32,13.33 11.62,13.33
  Bottom 0.254: 14,46 16.75,46 16.75,41 18.25,39.5 18.75,39.5 18.75,36.5 U201.11 | R6.P$1 38,25.75 39.5,25.75 40.25,25 R4.P$1 | U$14.T6 27.5,45.5 27.75,45.5 28.25,46 28.25,47.25 27.25,47.25 U$14.G2 | 48.25,53.25 48.26,53.25 | 44.25,57.25 44.3,57.43 | 46.25,56.25 46.45,56.45 | v5.25,22.75 5.25,14 7.75,14 C15.- | v8.75,50 8.75,57.5 9,57.75 L7.P$5 | 34.25,58.5 34.25,58.78 | 38.75,64.75 38.9,64.6 | 19.5,63 19.46,62.95
  Bottom 0.305: C28.2 11.24,32.24 v11.83,31.65 | v8.16,33.89 5.89,33.87 v4.82,33.86 | U$14.C4 13.82,44.47 14,44.65 14,46 14,46.74 U$14.G7 13.31,49.12 U$14.G6 | 44.01,2.84 U5.4 44.81,1.57 45.25,1.12 45.83,1.12 C18.1 | 44.01,2.84 C39.1 43.96,5.75 v43.65,6.05 | 44.01,2.84 44.01,1.54 C40.1 | C42.1 39.16,4.9 C38.- 39.22,4.99 v39.92,5.68 | U$14.G5 13.21,56.62 14.08,58.34 17.16,58.34 17.16,57.84 D4.2 | C8.2 27.17,39.21 U$14.G1 | v28.75,59.2 27.78,59.2 27.13,58.55 25.99,58.55 25.55,58.98 25.55,61.73 v25.88,62.06
  Bottom 0.61: U2.4 11.97,10.79 v12.01,10.83 12.01,12.63 10.87,13.77 C15.- 7.77,13.77 | 2.85,10.8 C24.1 2.76,10.63 C17.1 2.76,7.68 C16.1 3.59,7.14 JP6.1 R23.2
  pour Top (isolate 0.61, no thermals): 0.78,69.29 49.15,69.29 49.15,0.53 0.77,0.53 0.77,69.31 0.78,69.31
  pour Bottom (isolate 0.61, no thermals): 1,0.8 49.1,0.8 49.1,69.2 1,69.2
GPS_ANT
  Top 0.305: U$1.P$38 28.6,12.6 28.62,12.58 28.62,9.09 C2.1
GPS_SYNC  (via drill 0.3)
  Top 0.305: U$1.P$42 v25.4,16.42
  Bottom 0.254: C23.2 25.25,15 25.25,15.25 25.35,15.33
  Bottom 0.305: v25.4,16.42 25.35,15.33
MAIN_ANT
  Top 0.305: U$1.P$49 19.8,12.82 | 19.8,12.82 19.79,12.81 | 19.8,12.82 D3.A X2.P
N$1
  Top 0.305: L3.P$2 44.96,22.1 D9.C 45.1,22.24 J5.1
N$5
  Top 0.305: U$11.3 28.1,61.98 CN1.D+
N$6  (via drill 0.3)  (1 unrouted)
  Top 0.305: U$15.7 7.51,40.91 | R24.2 5.12,41.82 5.39,41.49 | 5.39,41.49 6.68,41.48 | 6.68,41.48 7.53,41.47 7.51,40.91 | RPUD3.2 5.3,41.84 RPUD0.2 5.69,41.54 5.39,41.49 | RPUD2.2 5.75,41.82 6.68,41.48 | 7.51,40.91 7.5,40.92 7.5,41.41 8.52,41.45 RPUD1.2 8.84,41.88 v8.9,41.94 | v12.07,43.79 12.07,44.79 v10.07,46.16
  Bottom 0.305: 8.9,42.16 v8.9,41.94 8.94,41.9 9.44,41.9 9.84,42.3 9.84,45.92 9.9,46.07 v10.07,46.16 | U$14.T4 12.29,43.57 v12.07,43.79
N$7
  Top 0.305: X3.P 30.79,3.22 C2.2 32.26,5.22 D201.A 32.27,6.93 L5.2
N$11  (via drill 0.3)
  Top 0.305: v7.34,49.76 7.43,49.85 J401.2 7.47,51.88 v7.47,54.59
  Bottom 0.305: R404.P$2 6.99,33.01 2.81,32.98 2.81,35.62 2.77,35.67 2.77,37.52 2.03,38.26 2.03,47.56 3.29,48.82 4.92,48.82 | 4.92,48.82 5.05,48.82 | v7.34,49.76 7.34,49.31 6.78,48.76 4.99,48.76 4.92,48.82 | JP12.1 13,63.24 7.47,56.99 v7.47,54.59
N$13  (via drill 0.3)
  Top 0.305: U$1.P$161 13.75,28.8 13.59,28.64 13.59,28.29 13.25,27.98 9.8,27.95 9.7,31.05 7.09,31.05 6.87,31.73 U$15.1 6.86,36.5 6.5,36.85 R24.1 3.08,36.85 2,37.93 2,45.53 2.88,46.41 8.88,46.42 9.45,47.03 9.91,47.04 10.45,47.02 v12.52,45.56
  Bottom 0.305: U$14.T3 12.83,45.25 v12.52,45.56
N$14  (via drill 0.3)
  Top 0.305: U$1.P$162 13.39,29.6 13,29.21 13,28.51 12.97,28.43 10.64,28.42 10.55,31.7 7.68,31.7 7.52,32.24 U$15.2 7.49,35.2 7.5,37.22 7.64,37.36 v7.85,37.41 | v11.77,38.12 11.79,38.02 v10.05,38.06 | v26.11,43.29 26.11,39.98 25.88,39.74 17.18,39.74 16.63,40.36 11.79,40.37 v11.79,40.34
  Bottom 0.305: v11.77,38.12 11.7,38.02 11.81,38.25 11.79,40.07 v11.79,40.34 | v10.05,38.06 7.87,38.06 v7.85,37.41 | U$14.T5 26.39,43.57 v26.11,43.29
N$15  (via drill 0.3)
  Top 0.305: U$1.P$163 12.94,30.4 12.84,30.5 12.84,32.36 12.65,32.36 10.25,32.34 9.55,32.33 8.8,32.33 U$15.4 8.83,35.21 v8.81,36.16 | RPUD3.1 3.68,44.24 v3.71,44.66 | v12.14,51.56 10.92,51.56 10.47,50.98 10.44,48.98 v10.14,48.62
  Bottom 0.305: v8.81,36.16 8.75,36.3 7.17,36.4 5.98,37.6 3.5,37.6 2.5,38.61 2.47,43.21 2.52,44.55 v3.71,44.66 3.75,44.68 3.77,47.92 9.53,47.91 v10.14,48.62 | U$14.T2 12.97,46.21 12.88,46.31 12.38,46.86 12.12,47.26 12.13,51.4 v12.14,51.56
N$16  (via drill 0.3)
  Top 0.305: U$1.P$164 13.63,31.2 13.35,31.48 13.35,32.83 13.28,32.9 10.69,32.96 9.87,32.95 9.62,33.39 9.63,36.47 8.79,38.19 U$15.5 8.87,39.65 v9.85,39.65 | RPUD2.1 6.99,44.62 | 6.99,44.62 7.53,44.98 10.35,44.99 10.84,44.77 10.86,41.4 v10.9,41.35 | v12.13,52.88 10.66,52.86 9.79,52.3 9.79,49.55 8.77,48.03 8.15,47.19 6.21,47.22 6.13,47.22 v5.12,47.24 | 6.58,45.24 v6.53,45.28 6.99,44.82 6.99,44.62
  Bottom 0.305: v10.9,41.35 10.9,40.7 v9.85,39.65 | U$14.T1 13.19,52.45 v12.13,52.88 | v6.53,45.28 6.39,45.49 v5.12,47.24
N$17  (via drill 0.3)
  Top 0.305: CN1.D- 28.84,60.08 v29.45,60.06 | v26.89,59.77 27.58,58.63 U$11.4
  Bottom 0.305: v29.45,60.06 27.09,60.12 v26.89,59.77
N$19  (via drill 0.3)
  Top 0.305: U$1.P$165 15.23,32 16,32.22 17.64,32.24 v17.57,32.4 | v17.55,35.05 19.32,35.46 19.32,35.93 19.31,38.41 | 19.31,38.41 17.96,39.24 11.03,39.24 10.64,39.88 10.14,40.8 | 10.14,40.8 8.72,40.82 8.22,40.44 8.2,39.75 U$15.6 | RPUD1.1 9.57,43.58 10.12,43.03 10.12,40.81 10.14,40.8 | 19.31,38.41 23.76,38.41 v24.46,37.72
  Bottom 0.305: v17.57,32.4 17.54,34.46 v17.55,35.05 | U$14.T8 26.44,50.79 26.07,50.82 18.91,50.84 18.43,50.21 18.32,43.08 25.67,42.8 25.77,38.16 25.29,37.72 | 25.29,37.72 25.25,37.68 | v24.46,37.72 25.29,37.72
N$20  (via drill 0.3)
  Top 0.305: U$15.8 6.8,38.64 v6.52,38.73 | U$1.P$166 15.71,32.8 v15.78,32.87 | RPUD0.1 5.56,45.01 5.23,45.52 3.07,45.51 2.64,45.08 2.58,40.67 v3.46,39.79 | v15.57,43.78 15.64,44.08 18.36,45.39 18.34,46.52 v19.42,47.78 | v12.14,36.3 11.3,37.03 v10.93,37.35
  Bottom 0.305: v15.78,32.87 15.78,35.24 | 15.78,35.24 15.65,35.31 12.99,35.31 v12.14,36.3 | v3.46,39.79 5.41,39.79 v6.52,38.73 10.93,38.7 10.88,37.42 11.08,37.27 v10.93,37.35 | 15.78,35.24 15.8,39 15.13,39.52 15.15,42.94 v15.57,43.78 | v19.42,47.78 20.72,46.21 U$14.T7
N$23  (1 unrouted)
  Top 0.305: 4.05,30.3 4.23,30.12 J1.1 | D10.C 4.67,32.87 L1.P$2
N$28  (via drill 0.3)
  Top 0.305: J5.5 42.89,28.88 v41.3,27.29
  Bottom 0.305: v41.3,27.29 36.84,27.29 R5.P$2
N$29  (via drill 0.3)
  Top 0.305: v44,26.29 45.16,26.32 J5.3
  Bottom 0.305: R3.P$2 42.48,23.25 43.58,23.8 43.56,26.08 v44,26.29
N$30
  Top 0.305: J5.4 42.83,27.62 41.3,26.09 40.58,26.09 R7.P$2
N$37
  Top 0.305: J201.1 L201.P$2 29.78,50.52 D8.C
N$38
  Top 0.305: Q3.3 44.5,49.23 R20.2
N$40  (via drill 0.3)
  Top 0.305: v21.72,41.04 21.74,41.72 R22.1
  Bottom 0.305: U201.16 21.28,40.43 v21.72,41.04
N$41  (via drill 0.3)
  Top 0.305: v23,41.07 23.04,41.76 R12.1
  Bottom 0.305: U201.17 21.78,40.05 v23,41.07
N$43  (via drill 0.3)
  Top 0.305: v24.56,40.56 24.56,41.73 R13.1
  Bottom 0.305: U201.18 22.3,39.79 22.95,40.35 24.41,40.42 v24.56,40.56
N$46
  Top 0.305: R9.P$2 41.13,21.88 41.9,22.65 41.9,24.86 42.13,25.09 45.07,25.09 J5.2
N$47  (via drill 0.3)
  Top 0.305: v20.46,40.91 20.49,41.73 R14.1
  Bottom 0.305: U201.15 20.76,40.61 v20.46,40.91
N$48  (via drill 0.3)
  Top 0.305: v16.06,19.95 16.73,19.93 U$1.P$54
  Bottom 0.305: U1.6 10.84,26.68 11.23,26.39 11.25,20.45 12.12,19.97 15.31,19.96 v16.06,19.95
N$49  (via drill 0.3)
  Top 0.305: v15.45,19.09 16.68,19.08 U$1.P$53
  Bottom 0.305: U1.7 10.63,26.15 10.7,25.89 10.69,19.91 11.86,19.1 15.34,19.1 v15.45,19.09
N$50  (via drill 0.3)
  Top 0.305: v16.07,18.38 16.78,18.38 U$1.P$52
  Bottom 0.305: U1.9 9.8,19.62 11.39,18.4 15.5,18.4 v16.07,18.38
N$51  (via drill 0.3)
  Top 0.305: v9.1,25.64 v7.77,27.39 | U$1.P$51 18.2,16.25 17.96,16.01 15.82,16.01 15.5,16.33 15.5,17.4 v15.48,17.42
  Bottom 0.305: U1.8 9.45,25.64 v9.1,25.64 | v7.77,27.39 7.8,26.73 7.85,23.97 | 7.85,23.97 8.22,23.62 | v15.48,17.42 10.97,17.43 9.14,18.81 9.14,22.57 8.28,23.61 8.21,23.59 7.85,23.97
N$52  (via drill 0.3)
  Top 0.305: U$1.P$3 19.81,31.72 v19.8,31.53
  Bottom 0.305: v19.8,31.53 19.84,33.05 U201.8
N$53  (via drill 0.3)
  Top 0.305: v3.53,25.13 J1.5
  Bottom 0.305: U1.12 v3.54,25.14 v3.53,25.13
N$54  (via drill 0.3)
  Top 0.305: v2.5,58.82 2.5,60.9 S2.2
  Bottom 0.305: U1.17 5.14,27.66 2.78,30.37 2.23,30.37 1.45,31.15 1.45,35.69 1.49,35.73 1.49,36.65 0.69,37.45 0.69,48.69 1.67,49.67 1.67,50.78 4.4,53.51 4.4,56.91 v2.5,58.82
N$56  (via drill 0.3)
  Top 0.305: v2.78,26.39 4.88,26.39 J1.4
  Bottom 0.305: U1.13 3.53,25.64 v2.78,26.39
N$57  (via drill 0.3)
  Top 0.305: v2.95,27.61 4.88,27.61 J1.3
  Bottom 0.305: U1.14 4.42,26.14 v2.95,27.61
N$58  (via drill 0.3)
  Top 0.305: v2.99,28.87 J1.2
  Bottom 0.305: U1.15 5.22,26.64 v2.99,28.87
N$59  (via drill 0.3)
  Top 0.305: v22.18,32.47 U$1.P$6
  Bottom 0.305: U201.5 21.33,33.39 v22.18,32.47
N$60  (via drill 0.3)
  Top 0.305: v21.41,31.48 U$1.P$5
  Bottom 0.305: U201.6 20.81,33.13 21.41,32.52 21.42,31.93 v21.41,31.48
N$61  (via drill 0.3)
  Top 0.305: v20.57,32.33 U$1.P$4
  Bottom 0.305: U201.7 20.33,32.53 v20.57,32.33
N$62
  Top 0.305: 9.48,3 PWR1.+
  Top 0.61: R25.1 9.48,3
N$63  (via drill 0.3)
  Top 0.254: v32,39.75 32,41 32.25,41.25 S1.1 32.5,41.5 37,41.5 37,42.5 38,43.5 v38.75,43.5
  Bottom 0.254: v32,39.75 31.95,39.69 | v38.75,43.5 42.75,39.5 44.25,39.5 JP7.1
  Bottom 0.305: U201.20 25.05,36.38 25.75,37.08 25.85,37.08 26.09,37.32 30.24,37.32 31.95,39.02 31.95,39.69 31.73,39.9
N$67
  Top 0.305: R20.1 44.49,55.06 D6.-
N$68
  Top 0.305: R11.2 47.78,47.06 R15.1 46.6,47.07 Q3.1
N$69
  Top 0.305: R21.2 37.8,48 Q4.3
N$70
  Top 0.305: D7.- 36.55,49.59 R21.1
N$71
  Top 0.305: Q4.1 41.08,46.98 R17.1 41.1,45.55 R16.2
N$72  (via drill 0.3)
  Top 0.305: v9.44,5.69 9.3,5.56 9.45,6.1 12.19,6.04 R19.1
  Bottom 0.305: U2.7 v9.43,5.68
  Bottom 0.61: v9.43,5.68 v9.44,5.69
N$74
  Top 0.305: J401.1 8.68,56.56 L7.P$2 10.15,57.03 D401.C
N$75  (via drill 0.3)
  Top 0.61: v4.16,2.36 3.9,2.69 2.9,3.29 2.79,10.35 4.9,12.78 7.38,11.42 v10.69,11.47
  Bottom 0.61: L9.1 5.84,1.65 D12.C 5.7,2.24 v4.16,2.36 | v10.69,11.47 U2.3
N$76
  Bottom 0.305: U1.20 7.29,30.06 R404.P$1
N$77
  Bottom 0.305: U1.18 5.38,28.16 4.56,29.57 4.56,30.07 R405.P$1
N$79  (via drill 0.3)
  Top 0.305: R1.1 19.18,40.96 v19.21,40.94
  Bottom 0.305: v19.21,40.94 19.24,40.94 19.78,40.47 19.8,39.17 U201.13
N$80  (via drill 0.3)
  Top 0.305: R18.1 17.77,41.04 v17.9,40.91
  Bottom 0.305: v17.9,40.91 19.3,39.84 U201.12
N$81  (via drill 0.3)
  Top 0.305: R1.2 19,44.29 19.75,44.97 19.75,45.77 21.72,47.82 21.72,51.27 21.45,51.54 v21.45,52.25 | JP5.1 18.52,63.78 25.98,55.59 25.98,55.23 v25.98,54.76
  Bottom 0.305: v25.98,54.76 23.98,54.7 v21.45,52.25
N$82
  Bottom 0.61: 2.66,5.95 R28.1 2.67,5.43 C4.2 2.62,4.61 2.62,3.88 2.77,3.74 5.03,3.74 R23.1 6.42,3.72
  Bottom 0.813: U2.5 11.97,6.79 11.47,7.29 9,7.31 6.96,7.23 6.42,3.72
N$83  (via drill 0.3)
  Top 0.305: R29.1 v47.38,7.12 v47.39,7.13
  Bottom 0.305: v47.39,7.13 47.39,8.13 U5.7
N$84  (via drill 0.3)
  Top 0.305: v45.58,5.34 45.58,7.96 46.5,8.88 47.44,8.88 v48.06,9.51
  Bottom 0.305: U5.3 46.08,4.84 v45.58,5.34 | v48.06,9.51 48.06,11.19 D2.C 45.8,11.52 L4.1
N$85
  Bottom 0.305: R30.1 43.66,9.78 C36.2 43.64,8.34 R31.1 44.66,8.32 U5.5
N$89  (via drill 0.3)
  Top 0.305: R18.2 17.52,43.9 17.7,44.08 18.04,44.41 19.1,45.3 19.1,46.22 20.98,48.27 20.98,51.17 19.3,52.85 v19.3,58.65
  Bottom 0.305: JP9.1 15.75,61.45 v19.3,58.65
N$90  (via drill 0.3)
  Top 0.305: v6,50.66 6.18,50.85 J401.3 6.25,51.91 v6.25,56.24
  Bottom 0.305: R405.P$2 4.57,32.13 2.08,32.18 2.08,36.03 2.1,36.05 2.1,37.08 1.43,37.75 1.43,47.99 3.41,49.97 5.54,49.97 6,50.42 v6,50.66 | JP8.1 10.26,62.51 6.25,57.78 v6.25,56.24
POWER_SW  (via drill 0.3)
  Top 0.305: U$1.P$59 v16.1,24
  Bottom 0.254: 16,24 16,23.75 C34.2
  Bottom 0.305: v16.1,24 16,24 13.15,24 12.37,24.54 12.38,26.89 11.5,27.67 U1.4
RESET  (via drill 0.3)
  Top 0.305: U$1.P$11 v26.16,32.46
  Bottom 0.305: 26.27,34.84 26.25,36.34 26.68,36.73 C33.2 | 26.27,34.84 26.27,32.87 v26.16,32.46 | U201.1 23.94,34.87 26.27,34.84
RF_DIV
  Top 0.305: U$1.P$31 36.66,19.99 36.66,15.99 37.4,15.26 43.72,15.26 44.68,16.48 D1.A X1.P
RX2  (via drill 0.3)
  Top 0.305: U$1.P$97 30.35,31.95 v29.7,32.73 | v29.23,35.5 26.47,35.58 v24.21,35.59
  Bottom 0.305: v29.7,32.73 29.6,32.89 29.3,33.3 29.3,35.05 v29.23,35.5 | U201.4 21.78,34.61 20.76,35.72 21.09,36.44 22.2,36.42 22.99,35.6 23.59,35.59 23.94,35.62 24.27,35.55 v24.21,35.59
SCL  (via drill 0.3)
  Top 0.305: U$1.P$1 18.19,31.4 17.74,31.74 16.04,31.74 15.57,31.34 v15.6,30.69 v15.59,30.68
  Bottom 0.305: v15.59,30.68 13.13,30.68 | 13.13,30.68 13.12,30.66 | U1.1 8.79,32.46 9.75,33.28 12.5,33.26 13.07,32.69 13.07,30.74 13.13,30.68
SD_DETECT  (via drill 0.3)
  Top 0.254: v29.75,54.75 27,54.75 27,56.5 19.75,63.75 19.75,64.5 21.75,66.5 v21.75,67.25 | v25.5,67.75 31,67.75 31,66.75 31.25,66.5 36,66.5 36.75,67.25 48.75,67.25 48.75,36 46.25,33.5 46.25,31 46.5,30.75 46.5,22.75 45.75,22 45.75,20.75 v44.25,19.25 | v41.5,19.25 40.25,19.25 40.25,18.75 C21.1
  Top 0.305: U$1.P$109 36.32,22.41 36.55,22.33 36.56,21.69 36.89,21.39 38.25,21.39 38.25,20.49 C21.1
  Bottom 0.254: v29.75,54.75 27.75,52.75 27,52.75 26.5,52.25 U$14.SW | v21.75,67.25 22.25,67.75 v25.5,67.75 | v41.5,19.25 v44.25,19.25
SDA  (via drill 0.3)
  Top 0.305: U$1.P$66 v16,29.6
  Bottom 0.305: v16,29.6 13.2,29.6 13.19,29.61 11.27,29.61 10.94,29.28 10.94,28.29 10.81,28.14 U1.3
SERIAL1_CTS
  Top 0.305: J201.3 27.34,45.94 26.74,45.34 23.75,45.34 23.18,44.77 23.18,43.5 R12.2
SERIAL1_RTS
  Top 0.305: 24.84,43.79 R13.2 24.55,43.5 24.55,44.32 24.82,44.59 27.46,44.59 28.59,45.72 J201.2
SERIAL1_RX
  Top 0.305: J201.5 24.84,47.57 24.38,47.1 21.83,47.1 20.52,45.78 20.52,43.55 R14.2
SERIAL1_TX
  Top 0.305: J201.4 26.09,46.72 25.54,46.17 22.88,46.17 21.92,45.22 21.92,43.53 R22.2
SIM_CLK  (via drill 0.3)
  Top 0.305: U$1.P$27 v34.54,23.2
  Bottom 0.305: v34.54,23.2 35.57,23.2 37.25,21.56 37.31,21.48 45.99,21.45 47.28,22.12 47.2,31.16 34.92,43.43 | D4.5 17.07,55.59 17.07,55.16 20.13,55.09 20.36,55.32 20.72,55.71 20.99,56.04 33.62,55.98 35.36,54.13 35.46,44.18 34.92,43.43 | U$14.C3 33.31,41.82 34.92,43.43
SIM_DATA  (via drill 0.3)
  Top 0.305: U$1.P$28 33.75,22.4 v33.88,22.37 | v36.58,45.58 v34.5,45.57 | R2.2 18.39,51.36 18.41,51.98 18.26,55.86 v18.24,55.91
  Bottom 0.305: v33.88,22.37 35.32,22.38 36.81,20.91 46.45,20.87 47.91,21.67 47.85,31.93 36.48,43.41 | D4.4 17.96,55.92 17.96,55.96 v18.24,55.91 19.8,55.91 19.92,56.03 20.46,56.95 34.19,56.9 36.64,54.04 36.48,43.41 | 36.48,43.41 36.57,45.47 v36.58,45.58 | v34.5,45.57 34.49,45.58 31.65,42.74 27.33,42.74 U$14.C6
SIM_DETECT  (via drill 0.3)
  Top 0.305: U$1.P$64 v16.63,28.02 | v14.18,52.4 14.16,43.14 16,42.12 16.02,41.78 v15.99,41.6
  Bottom 0.305: v16.63,28.02 17.04,28.2 17.04,30.9 16.59,31.54 16.64,39.21 16.64,39.97 16.44,40.17 15.98,40.57 15.98,41.16 v15.99,41.6 | D4.1 15.06,57.76 14.2,56.23 14.22,53.47 14.21,52.51 14.25,52.53 v14.18,52.4
SIM_RST  (via drill 0.3)
  Top 0.305: U$1.P$29 v34.55,21.6
  Bottom 0.305: v34.55,21.6 35.05,21.62 36.39,20.29 36.48,20.22 46.69,20.22 48.64,21.2 48.56,32.67 37.73,43.14 37.87,54.2 34.84,57.72 D4.3 17.98,57.69 17.95,58.25 17.54,58.96 12.14,58.96 11.41,56.85 11.31,42.34 11.82,41.82 U$14.C2
TX2  (via drill 0.3)
  Top 0.305: U$1.P$96 32.51,32.75 v31.16,32.78
  Bottom 0.305: U201.3 22.31,33.49 24.16,30.72 28.32,30.74 28.71,31.88 30.25,31.88 v31.15,32.78 v31.16,32.78
TX_ACTIVITY  (via drill 0.3)
  Top 0.305: U$1.P$60 v15.41,24.8 | v41.07,35.18 41.08,35.5 41.02,42.85 41.02,43.95 R16.1
  Bottom 0.305: v15.41,24.8 19.95,26.31 19.95,29.65 20.25,29.94 35.82,29.94 40.97,35.09 40.97,35.13 v41.07,35.18
USB_VBUS
  Top 0.305: CN1.VBUS 29.64,61.26 30.38,60.52 30.38,59.86 | 30.38,59.86 30.38,59.22 U$12.P$6 | 30.38,59.86 30.43,59.91 C11.2 32.47,59.93
W_DISABLE  (via drill 0.3)
  Top 0.305: U$1.P$151 15.03,20.8 v15.09,20.8
  Bottom 0.254: C35.2 15.5,21 15.25,21 v15.09,20.8
  Bottom 0.305: v15.09,20.8 12.47,20.81 11.85,21.25 11.85,26.64 11.11,27.19 U1.5
WAN_LED
  Top 0.305: U$1.P$106 36.5,24.8 36.55,24.86 36.55,26.04 37.1,26.59 38.05,26.59 38.02,27.55 38.52,27.92 39.4,28.6 39.37,31.93 47.78,40.34 R11.1